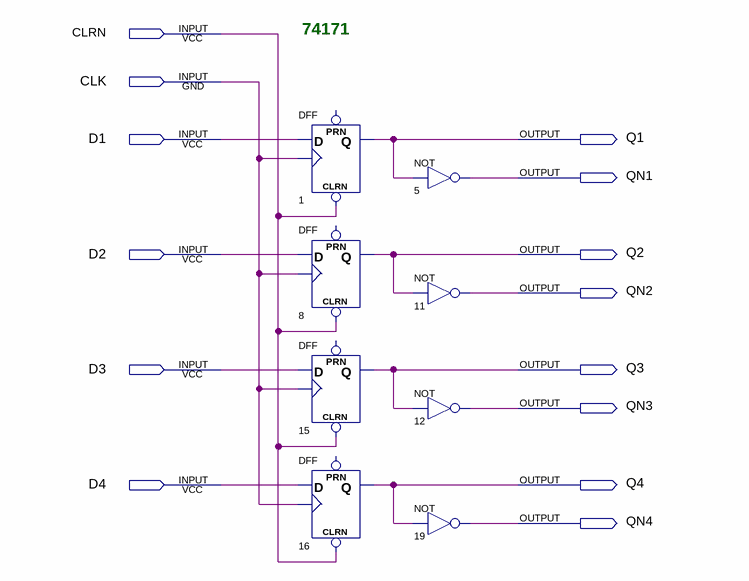
[diagram p0: schematic sheet]
// Quartus schematic 74171.bdf as structural Verilog: 8 symbols, 14 pins
module \74171  (
  input  CLRN,
  input  CLK,
  input  D1,
  input  D2,
  input  D3,
  input  D4,
  output Q1,
  output QN1,
  output Q2,
  output QN2,
  output Q3,
  output QN3,
  output Q4,
  output QN4
);

  DFF u_1 (.CLRN(CLRN), .CLK(CLK), .D(D1), .Q(Q1));  // open: PRN
  DFF u_8 (.CLRN(CLRN), .CLK(CLK), .D(D2), .Q(Q2));  // open: PRN
  DFF u_15 (.CLRN(CLRN), .CLK(CLK), .D(D3), .Q(Q3));  // open: PRN
  DFF u_16 (.CLRN(CLRN), .CLK(CLK), .D(D4), .Q(Q4));  // open: PRN
  not u_5 (QN1, Q1);
  not u_11 (QN2, Q2);
  not u_12 (QN3, Q3);
  not u_19 (QN4, Q4);

  // Notes on the sheet:
  //   74171
endmodule
